# EAGLE design PecanPico4 (EAGLE 6.5.0)
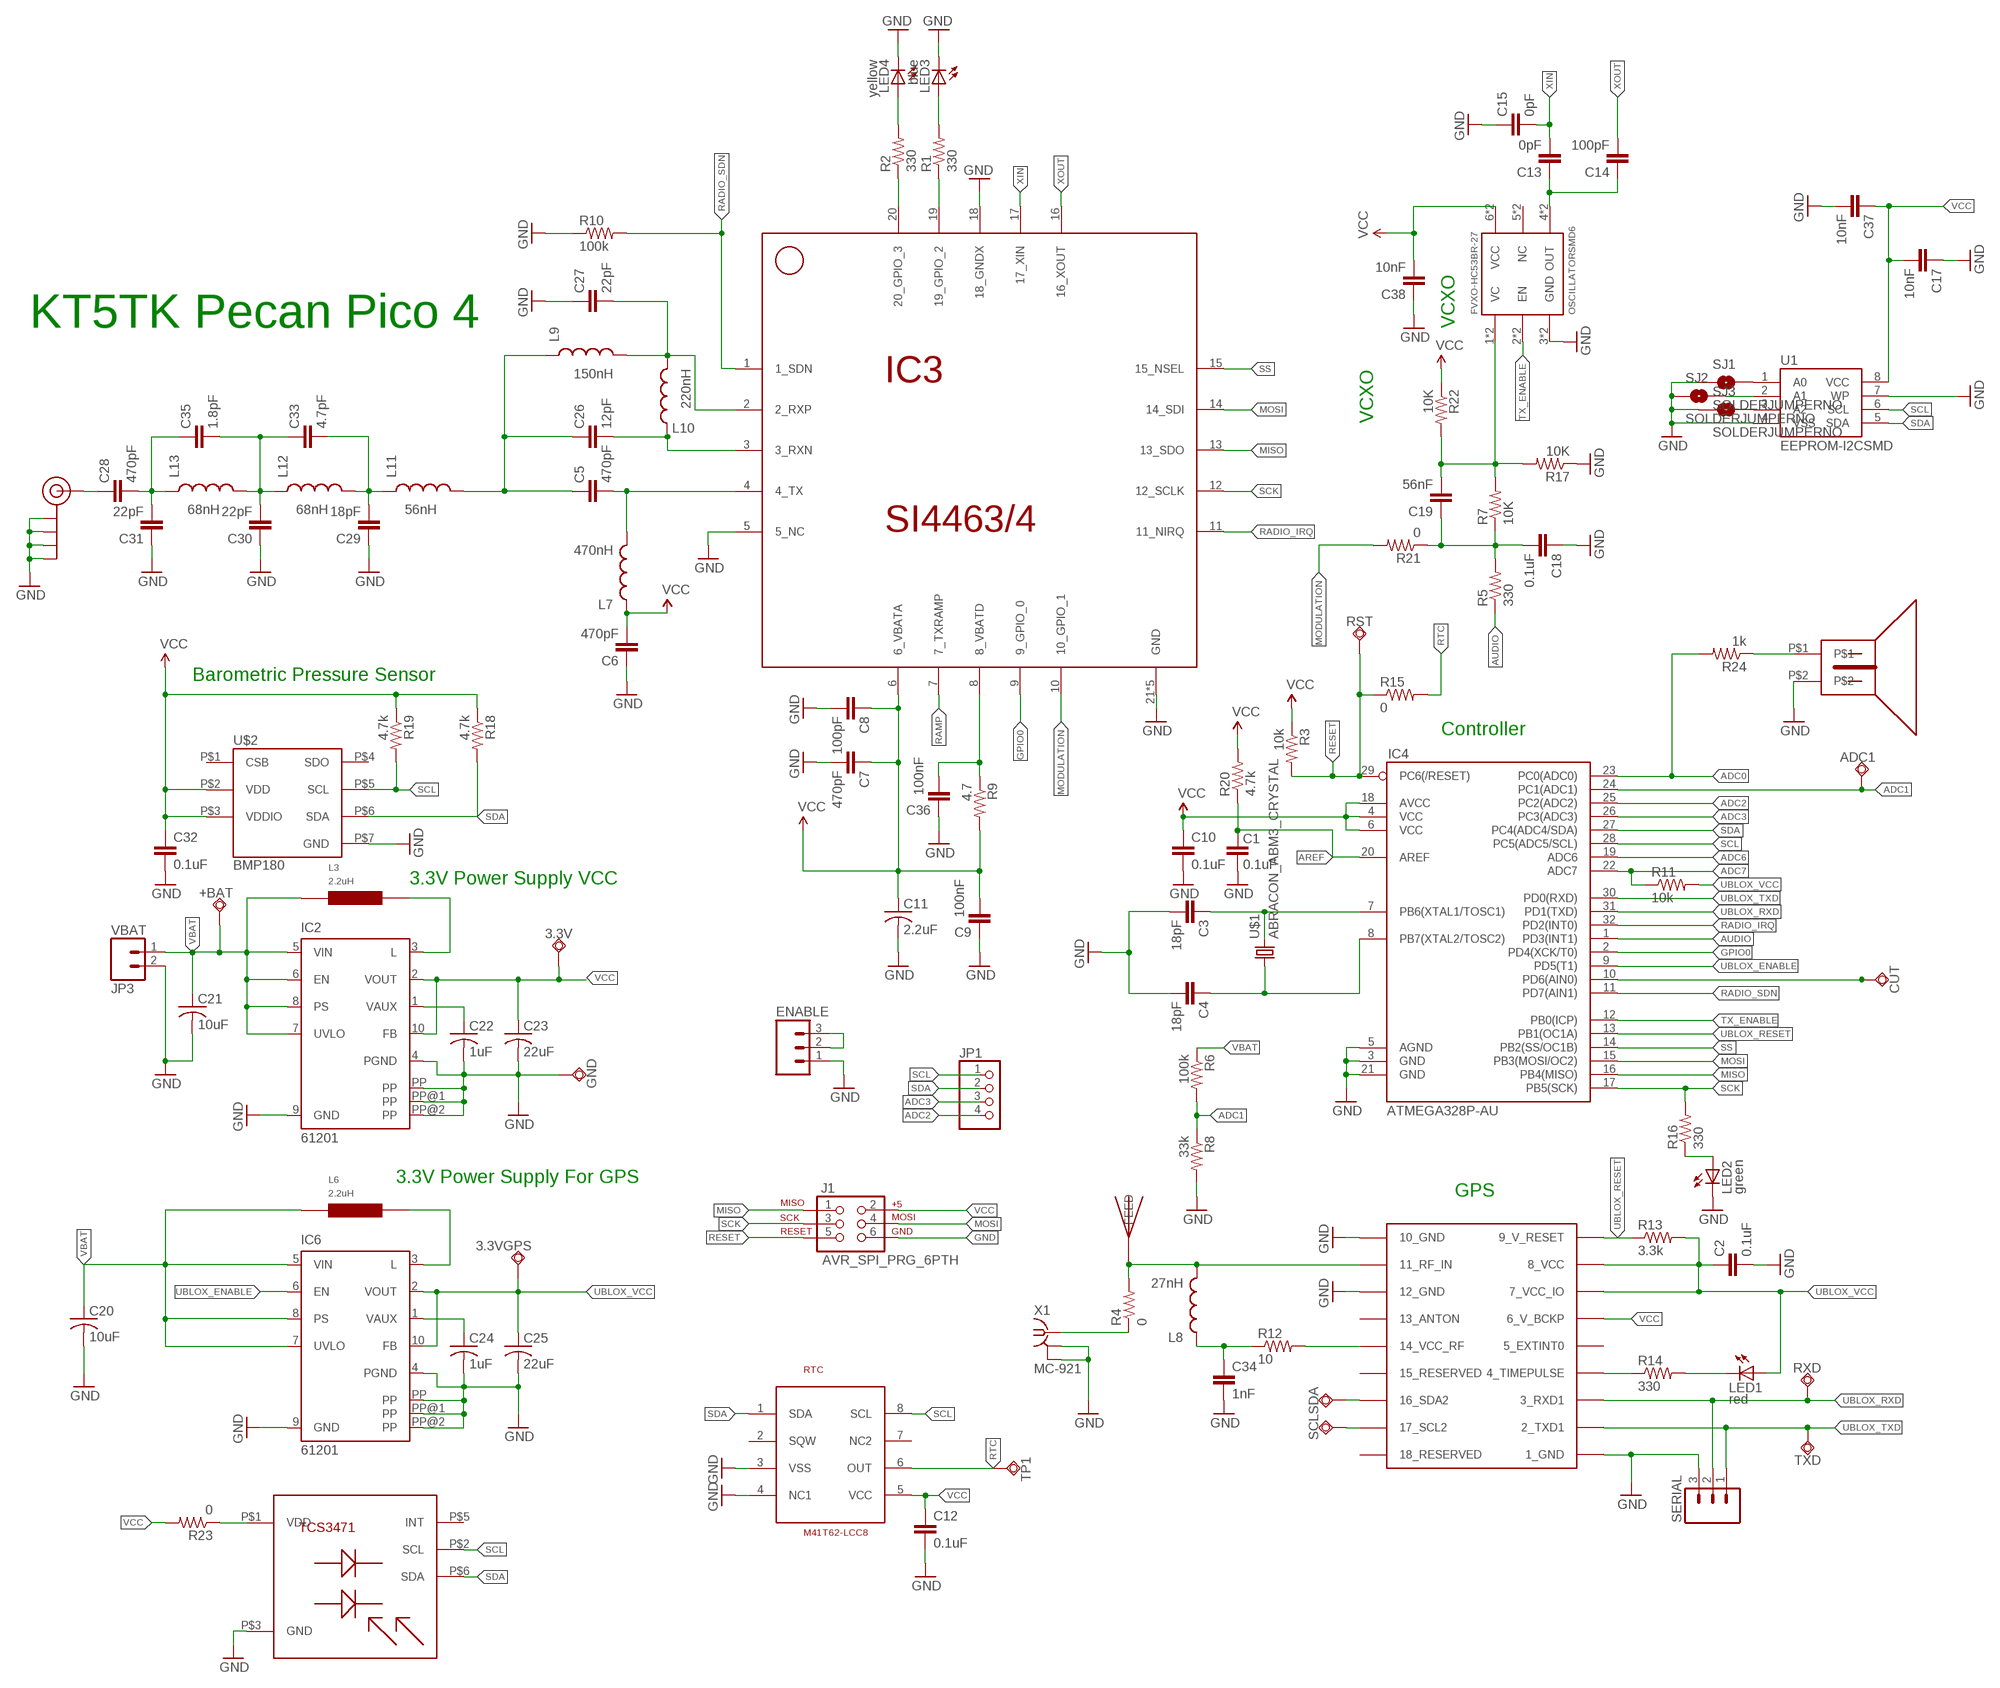
[diagram p0: schematic, sheet 1]

## Parts
3.3V  TPSQTP06R  [TP06R]
3.3VGPS  TPSQTP06R  [TP06R]
+BAT  TPSQTP06R  [TP06R]
ADC1  TPSQTP06R  [TP06R]
C1  0.1uF  CAP0402-CAP  [0402-CAP]
C2  0.1uF  CAP0402-CAP  [0402-CAP]
C3  18pF  CAP0402-CAP  [0402-CAP]
C4  18pF  CAP0402-CAP  [0402-CAP]
C5  470pF  CAP0402-CAP  [0402-CAP]
C6  470pF  CAP0402-CAP  [0402-CAP]
C7  470pF  CAP0402-CAP  [0402-CAP]
C8  100pF  CAP0402-CAP  [0402-CAP]
C9  100nF  CAP0402-CAP  [0402-CAP]
C10  0.1uF  CAP0402-CAP  [0402-CAP]
C11  2.2uF  C-USC1206  [C1206]
C12  0.1uF  CAP0402-CAP  [0402-CAP]
C13  0pF  CAP0402-CAP  [0402-CAP]
C14  100pF  CAP0402-CAP  [0402-CAP]
C15  0pF  CAP0402-CAP  [0402-CAP]
C17  10nF  CAP0402-CAP  [0402-CAP]
C18  0.1uF  CAP0402-CAP  [0402-CAP]
C19  56nF  CAP0402-CAP  [0402-CAP]
C20  10uF  C-USC1206  [C1206]
C21  10uF  C-USC1206  [C1206]
C22  1uF  C-USC1206  [C1206]
C23  22uF  C-USC1206  [C1206]
C24  1uF  C-USC1206  [C1206]
C25  22uF  C-USC1206  [C1206]
C26  12pF  CAP0402-CAP  [0402-CAP]
C27  22pF  CAP0402-CAP  [0402-CAP]
C28  470pF  CAP0402-CAP  [0402-CAP]
C29  18pF  CAP0402-CAP  [0402-CAP]
C30  22pF  CAP0402-CAP  [0402-CAP]
C31  22pF  CAP0402-CAP  [0402-CAP]
C32  0.1uF  CAP0402-CAP  [0402-CAP]
C33  4.7pF  CAP0402-CAP  [0402-CAP]
C34  1nF  CAP0402-CAP  [0402-CAP]
C35  1.8pF  CAP0402-CAP  [0402-CAP]
C36  100nF  CAP0402-CAP  [0402-CAP]
C37  10nF  CAP0402-CAP  [0402-CAP]
C38  10nF  CAP0402-CAP  [0402-CAP]
CUT  TPSQTP06R  [TP06R]
ENABLE  M03PTH  [1X03]
FVXO-HC53BR-27  OSCILLATORSMD6  [CRYSTAL-SMD-7.5X5.2-6PIN]
GND  TPSQTP06R  [TP06R]
IC2  61201  TPS61201  [S-PDSO-N10]
IC3  SI4463/4  [QFN-20]
IC4  ATMEGA328P-AU  ATMEGA168  [TQFP32-08]
IC5  UBLOX_MAX-6  [UBLOX_MAX-6]
IC6  61201  TPS61201  [S-PDSO-N10]
J1  AVR_SPI_PRG_6PTH  [2X3]
J$2  SMA_EDGE  [SMA-EDGE]
JP1  PINHD-1X4  [1X04]
JP3  VBAT  M02PTH  [1X02]
L3  2.2uH  LPS3015  [LPS3015]
L6  2.2uH  LPS3015  [LPS3015]
L7  470nH  INDUCTOR0603  [0603]
L8  27nH  INDUCTOR0603  [0603]
L9  150nH  INDUCTOR0603  [0603]
L10  220nH  INDUCTOR0603  [0603]
L11  56nH  INDUCTOR0603  [0603]
L12  68nH  INDUCTOR0603  [0603]
L13  68nH  INDUCTOR0603  [0603]
LED1  red  LED0603  [LED-0603]
LED2  green  LED0603  [LED-0603]
LED3  blue  LED0603  [LED-0603]
LED4  yellow  LED0603  [LED-0603]
R1  330  RESISTOR0402-RES  [0402-RES]
R2  330  RESISTOR0402-RES  [0402-RES]
R3  10k  RESISTOR0402-RES  [0402-RES]
R4  0  RESISTOR0402-RES  [0402-RES]
R5  330  RESISTOR0402-RES  [0402-RES]
R6  100k  RESISTOR0402-RES  [0402-RES]
R7  10K  RESISTOR0402-RES  [0402-RES]
R8  33k  RESISTOR0402-RES  [0402-RES]
R9  4.7  RESISTOR0402-RES  [0402-RES]
R10  100k  RESISTOR0402-RES  [0402-RES]
R11  10k  RESISTOR0402-RES  [0402-RES]
R12  10  RESISTOR0402-RES  [0402-RES]
R13  3.3k  RESISTOR0402-RES  [0402-RES]
R14  330  RESISTOR0402-RES  [0402-RES]
R15  0  RESISTOR0402-RES  [0402-RES]
R16  330  RESISTOR0402-RES  [0402-RES]
R17  10K  RESISTOR0402-RES  [0402-RES]
R18  4.7k  RESISTOR0402-RES  [0402-RES]
R19  4.7k  RESISTOR0402-RES  [0402-RES]
R20  4.7k  RESISTOR0402-RES  [0402-RES]
R21  0  RESISTOR0402-RES  [0402-RES]
R22  10K  RESISTOR0402-RES  [0402-RES]
R23  0  RESISTOR0402-RES  [0402-RES]
R24  1k  RESISTOR0402-RES  [0402-RES]
RST  TPSQTP06R  [TP06R]
RTC  M41T62-LCC8  [LCC-8]
RXD  TPSQTP06R  [TP06R]
SCL  TPSQTP06R  [TP06R]
SDA  TPSQTP06R  [TP06R]
SERIAL  M03PTH  [1X03]
SJ1  SOLDERJUMPERNO  [SJ_2S-NO]
SJ2  SOLDERJUMPERNO  [SJ_2S-NO]
SJ3  SOLDERJUMPERNO  [SJ_2S-NO]
SPKR  PKLCS1212E  [PKLCS1212E]
TCS3471  TCS4371FN  [TCS3471FN]
TP1  TPSQTP06R  [TP06R]
TXD  TPSQTP06R  [TP06R]
U1  EEPROM-I2CSMD  [SO08]
U$1  ABRACON_ABM3_CRYSTAL  [ABRACON_ABM3_CRYSTAL]
U$2  BMP180  [LGA-7]
U$3  JTI_ANTENNA-1575AT43A40  [JTI_ANTENNA-1575AT43A40]
X1  MC-921  [MC-921]

## Nets
ADC0: IC4.23(PC0(ADC0)) R24.2
ADC1: ADC1.TP IC4.24(PC1(ADC1)) R6.2 R8.1
ADC2: IC4.25(PC2(ADC2))
ADC3: IC4.26(PC3(ADC3))
ADC6: IC4.19(ADC6)
ADC7: IC4.22(ADC7) R11.1
AREF: C1.2 IC4.20(AREF) R20.1
AUDIO: IC4.1(PD3(INT1)) R5.1
CUT: CUT.TP IC4.10(PD6(AIN0))
GND [vcc]: C1.1 C2.2 C3.2 C4.2 C6.1 C7.2 C8.2 C9.1 C10.2 C11.2 C12.2 C15.1 C17.1 C18.1 C20.2 C21.2 C22.2 C23.2 C24.2 C25.2 C27.1 C29.1 C30.1 C31.1 C32.2 C34.2 C36.1 C37.2 C38.1 ENABLE.1 FVXO-HC53BR-27.3(GND) FVXO-HC53BR-27.3INNER(GND) GND.TP IC2.4(PGND) IC2.9(GND) IC2.PP IC2.PP@1(PP) IC2.PP@2(PP) IC3.5(5_NC) IC3.18(18_GNDX) IC3.21(GND) IC3.22(GND) IC3.23(GND) IC3.24(GND) IC3.25(GND) IC4.3(GND) IC4.5(AGND) IC4.21(GND) IC5.1_GND IC5.10_GND IC5.12_GND IC6.4(PGND) IC6.9(GND) IC6.PP IC6.PP@1(PP) IC6.PP@2(PP) J1.6 J$2.GND@0(GND) J$2.GND@1(GND) J$2.GND@2(GND) J$2.GND@3(GND) JP3.2 LED2.C LED3.C LED4.C R8.2 R10.1 R17.1 RTC.3(VSS) RTC.4(NC1) SERIAL.3 SJ1.1 SJ2.1 SJ3.1 SPKR.P$2 TCS3471.P$3(GND) U1.4(VSS) U1.7(WP) U$2.P$7(GND) X1.2@1(GND) X1.2@2(GND)
GPIO0: IC3.9(9_GPIO_0) IC4.2(PD4(XCK/T0))
GPSANT: IC5.11_RF_IN L8.2 R4.2 U$3.FEED
MISO: IC3.13(13_SDO) IC4.16(PB4(MISO)) J1.1
MODULATION: IC3.10(10_GPIO_1) R21.2
MOSI: IC3.14(14_SDI) IC4.15(PB3(MOSI/OC2)) J1.4
N$1: R23.1 TCS3471.P$1(VDD)
N$2: IC5.16_SDA2 SDA.TP
N$3: IC5.17_SCL2 SCL.TP
N$4: IC2.3(L) L3.P$2
N$5: IC3.20(20_GPIO_3) R2.1
N$6: C18.2 C19.1 R5.2 R7.1 R21.1
N$7: IC3.19(19_GPIO_2) R1.1
N$8: SJ1.2 U1.1(A0)
N$9: C3.1 IC4.7(PB6(XTAL1/TOSC1)) U$1.P$2
N$10: C4.1 IC4.8(PB7(XTAL2/TOSC2)) U$1.P$1
N$11: LED4.A R2.2
N$12: LED3.A R1.2
N$13: C13.1 C14.1 FVXO-HC53BR-27.4(OUT) FVXO-HC53BR-27.4INNER(OUT)
N$14: R4.1 X1.1
N$15: SJ3.2 U1.3(A2)
N$16: SJ2.2 U1.2(A1)
N$17: R24.1 SPKR.P$1
N$18: JP1.1
N$19: C22.1 IC2.1(VAUX)
N$20: IC6.3(L) L6.P$2
N$21: C19.2 FVXO-HC53BR-27.1(VC) FVXO-HC53BR-27.1INNER(VC) R7.2 R17.2 R22.2
N$22: C24.1 IC6.1(VAUX)
N$23: C5.2 IC3.4(4_TX) L7.2
N$24: C28.1 J$2.SIG(SIGNAL)
N$25: C26.2 IC3.3(3_RXN) L10.1
N$26: C27.2 IC3.2(2_RXP) L9.2 L10.2
N$27: C5.1 C26.1 L9.1 L11.2
N$28: C30.2 C33.1 C35.2 L12.1 L13.2
N$29: ENABLE.2 ENABLE.3
N$30: IC5.14_VCC_RF R12.2
N$31: C34.1 L8.1 R12.1
N$32: IC5.4_TIMEPULSE R14.1
N$33: LED1.C R14.2
N$34: C29.2 C33.2 L11.1 L12.2
N$35: C28.2 C31.2 C35.1 L13.1
N$36: LED2.A R16.1
N$37: JP1.2
N$38: JP1.3
N$39: JP1.4
N$41: C36.2 IC3.8(8_VBATD) R9.1
RADIO_IRQ: IC3.11(11_NIRQ) IC4.32(PD2(INT0))
RADIO_SDN: IC3.1(1_SDN) IC4.11(PD7(AIN1)) R10.2
RAMP: IC3.7(7_TXRAMP)
RESET: IC4.29(PC6(/RESET)) J1.5 R3.2 R15.1 RST.TP
RTC: R15.2 RTC.6(OUT) TP1.TP
SCK: IC3.12(12_SCLK) IC4.17(PB5(SCK)) J1.3 R16.2
SCL: IC4.28(PC5(ADC5/SCL)) R19.2 RTC.8(SCL) TCS3471.P$2(SCL) U1.6(SCL) U$2.P$5(SCL)
SDA: IC4.27(PC4(ADC4/SDA)) R18.2 RTC.1(SDA) TCS3471.P$6(SDA) U1.5(SDA) U$2.P$6(SDA)
SS: IC3.15(15_NSEL) IC4.14(PB2(SS/OC1B))
TX_ENABLE: FVXO-HC53BR-27.2(EN) FVXO-HC53BR-27.2INNER(EN) IC4.12(PB0(ICP))
UBLOX_ENABLE: IC4.9(PD5(T1)) IC6.6(EN)
UBLOX_RESET: IC4.13(PB1(OC1A)) IC5.9_V_RESET R13.1
UBLOX_RXD: IC4.31(PD1(TXD)) IC5.3_RXD1 RXD.TP SERIAL.2
UBLOX_TXD: IC4.30(PD0(RXD)) IC5.2_TXD1 SERIAL.1 TXD.TP
UBLOX_VCC: 3.3VGPS.TP C2.1 C25.1 IC5.7_VCC_IO IC5.8_VCC IC6.2(VOUT) IC6.10(FB) LED1.A R11.2 R13.2
VBAT [vcc]: +BAT.TP C20.1 C21.1 IC2.5(VIN) IC2.6(EN) IC2.7(UVLO) IC2.8(PS) IC6.5(VIN) IC6.7(UVLO) IC6.8(PS) JP3.1 L3.P$1 L6.P$1 R6.1
VCC: 3.3V.TP C6.2 C7.1 C8.1 C9.2 C10.1 C11.1 C12.1 C17.2 C23.1 C32.1 C37.1 C38.2 FVXO-HC53BR-27.6(VCC) FVXO-HC53BR-27.6INNER(VCC) IC2.2(VOUT) IC2.10(FB) IC3.6(6_VBATA) IC4.4(VCC) IC4.6(VCC) IC4.18(AVCC) IC5.6_V_BCKP J1.2 L7.1 R3.1 R9.2 R18.1 R19.1 R20.2 R22.1 R23.2 RTC.5(VCC) U1.8(VCC) U$2.P$2(VDD) U$2.P$3(VDDIO)
XIN: C13.2 C15.2 IC3.17(17_XIN)
XOUT: C14.2 IC3.16(16_XOUT)
Unconnected: FVXO-HC53BR-27.5(NC) FVXO-HC53BR-27.5INNER(NC) IC5.5_EXTINT0 IC5.13_ANTON IC5.15_RESERVED IC5.18_RESERVED RTC.2(SQW) RTC.7(NC2) TCS3471.P$5(INT) U$2.P$1(CSB) U$2.P$4(SDO)

## Notes on the sheet
- KT5TK Pecan Pico 4 | VCXO
- VCXO
- Barometric Pressure Sensor
- Controller
- 3.3V Power Supply VCC
- 3.3V Power Supply For GPS
- GPS

## Library data of the parts
3.3V 3.3VGPS +BAT ADC1 CUT GND RST RXD SCL SDA TP1 TXD = testpad:TPSQ: Test pad
C1-C10 C12-C15 C17-C19 C26-C38 = SparkFun:CAP: Capacitor Standard 0603 ceramic capacitor, and 0.1" leaded capacitor.
C11 C20-C25 = rcl:C-US: CAPACITOR, American symbol
ENABLE SERIAL = SparkFun-Connectors:M03: Header 3 Standard 3-pin 0.1" header. Use with straight break away headers (SKU : PRT-00116), right angle break away headers (PRT-00553), swiss pins (PRT-00743), machine pins (PRT-00117), and female headers (PRT-00115). Molex polarized connector foot print use with SKU : PRT-08232 with associated crimp pins and housings.
FVXO-HC53BR-27 = SparkFun-FreqCtrl_TK:OSCILLATOR: Generic 5x3 and 7x5 oscillators
IC2 IC6 = texas:TPS6120*: LOW INPUT VOLTAGE SYNCHRONOUS BOOST CONVERTER WITH 1.3-A SWITCHES Source: http://focus.ti.com/lit/ds/symlink/tps61200.pdf; MPN: TPS61201DRCT; OC_FARNELL: unknown; OC_NEWARK: 37M0068
IC3 = KT5TK:SI4463/4
IC4 = SparkFun:ATMEGA168
IC5 = ava:UBLOX_MAX-6: UBLOX MAX-6
J1 = SparkFun:AVR_SPI_PRG_6: AVR ISP 6 Pin This is the reduced ISP connector for AVR programming. Common on Arduino. This footprint will take up less PCB space and can be used with a 10-pin to 6-pin adapter such as SKU: BOB-08508
J$2 = SparkFun:SMA_EDGE: SMA Antenna Connector End launch SMA connector. The paste layer has been removed so that the connector can be hand soldered onto the board after reflow.
JP1 = pinhead:PINHD-1X4: PIN HEADER
JP3 = SparkFun:M02: Header 2 Standard 2-pin 0.1" header. Use with straight break away headers (SKU : PRT-00116), right angle break away headers (PRT-00553), swiss pins (PRT-00743), machine pins (PRT-00117), and female headers (PRT-00115). Molex polarized connector foot print use with SKU : PRT-08233 with associated crimp pins and housings.
L3 L6 = inductor-coilcraft-TK:LPS3015: LPS3015 Series Low Profile Shielded Power Inductors http://www.coilcraft.com/lps3015.cfm <0.058>
L7-L13 = SparkFun:INDUCTOR: Inductors Basic Inductor/Choke - 0603 and 1206. Footprints are not proven and vary greatly between part numbers.
LED1-LED4 = SparkFun:LED: LEDs Standard schematic elements and footprints for 5mm, 3mm, 1206, and 0603 sized LEDs. 5mm - Spark Fun Electronics SKU : COM-00529 (and others)
R1-R24 = SparkFun:RESISTOR: Resistor Basic schematic elements and footprints for 0603, 1206, and PTH resistors.
RTC = KT5TK:M41T62-LCC8
SJ1-SJ3 = SparkFun-Passives:SOLDERJUMPER: Solder Jumper Standard SMD solder jumper. Used to automate production. Two varients : Normally Open and Normally Closed are the same, but have different paste layers. NC will have a large amount of paste and should jumper during reflow.
SPKR = KT5TK:PKLCS1212E
TCS3471 = KT5TK:TCS4371FN: TCS4371FN Color Sensor The TCS3471 family of devices provides red, green, blue, and clear light sensing (RGBC) that detects light intensity under a variety of lighting conditions and through a variety of attenuation materials. An internal state machine provides the ability to put the device into a low power mode in between RGBC measurements providing very low average power consumption. The TCS3471 is directly useful in lighting conditions containing minimal IR content such as LED RGB backlight control, reflected LED color sampler, or fluorescent light color temperature detector. With the addition of an IR blocking filter, the device is an excellent ambient light sensor, color temperature monitor, and general purpose color sensor.
U1 = SparkFun-DigitalIC:EEPROM-I2C: I2C EEPROM chips, 24LC256 (and others)
U$1 = ava:ABRACON_ABM3_CRYSTAL
U$2 = projecttree:BMP180
U$3 = ava:JTI_ANTENNA-1575AT43A40
X1 = con-coax:MC-921: COAX. MICROWAVE CONNECTOR O/D diam 2.1 Source: www.tycoelectronics.com .. Electronics .. ENG_CD_1775146_A2.pdf; OC_FARNELL: unknown; OC_NEWARK: unknown

## Net classes
0 default: width 0.203 mm
1 vcc: width 0.254 mm

## Board
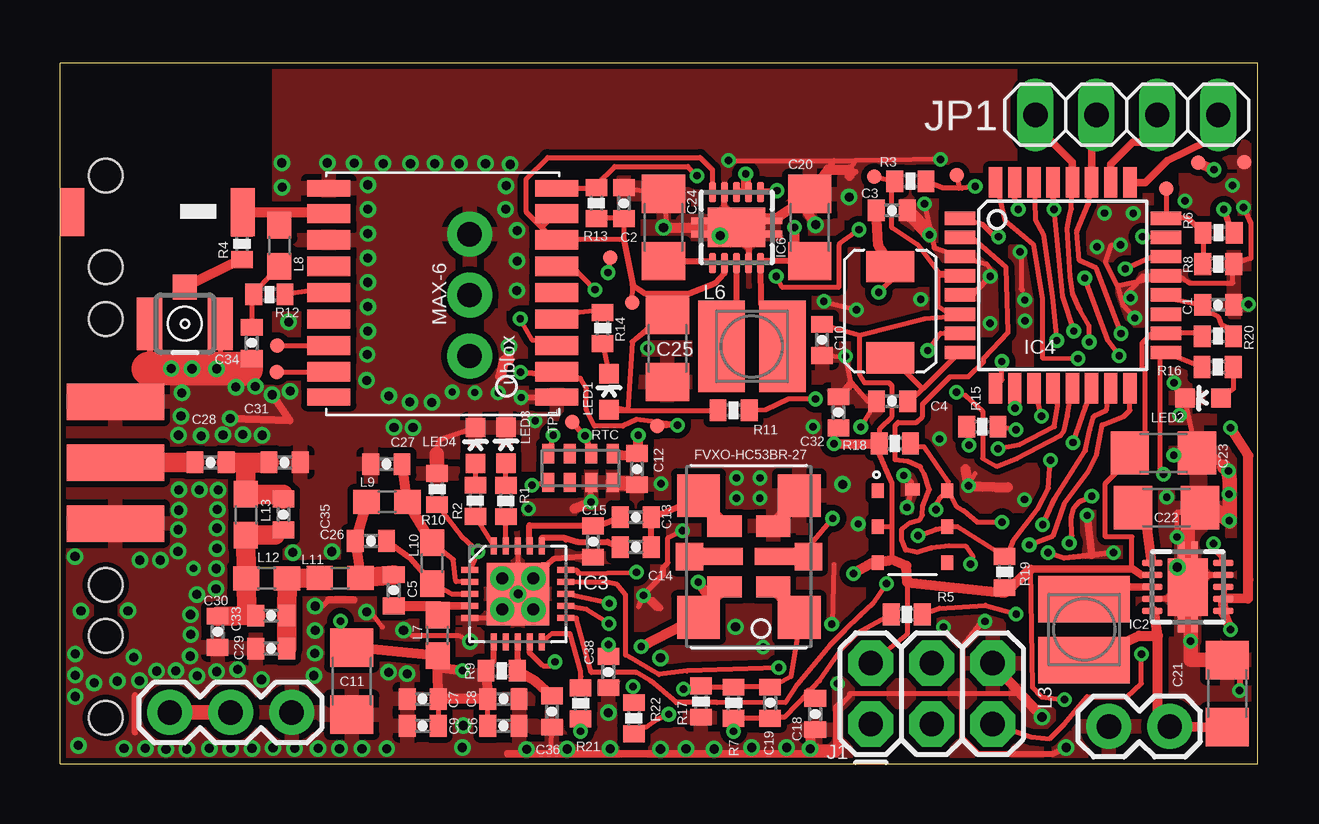
[diagram p1: board, top side]
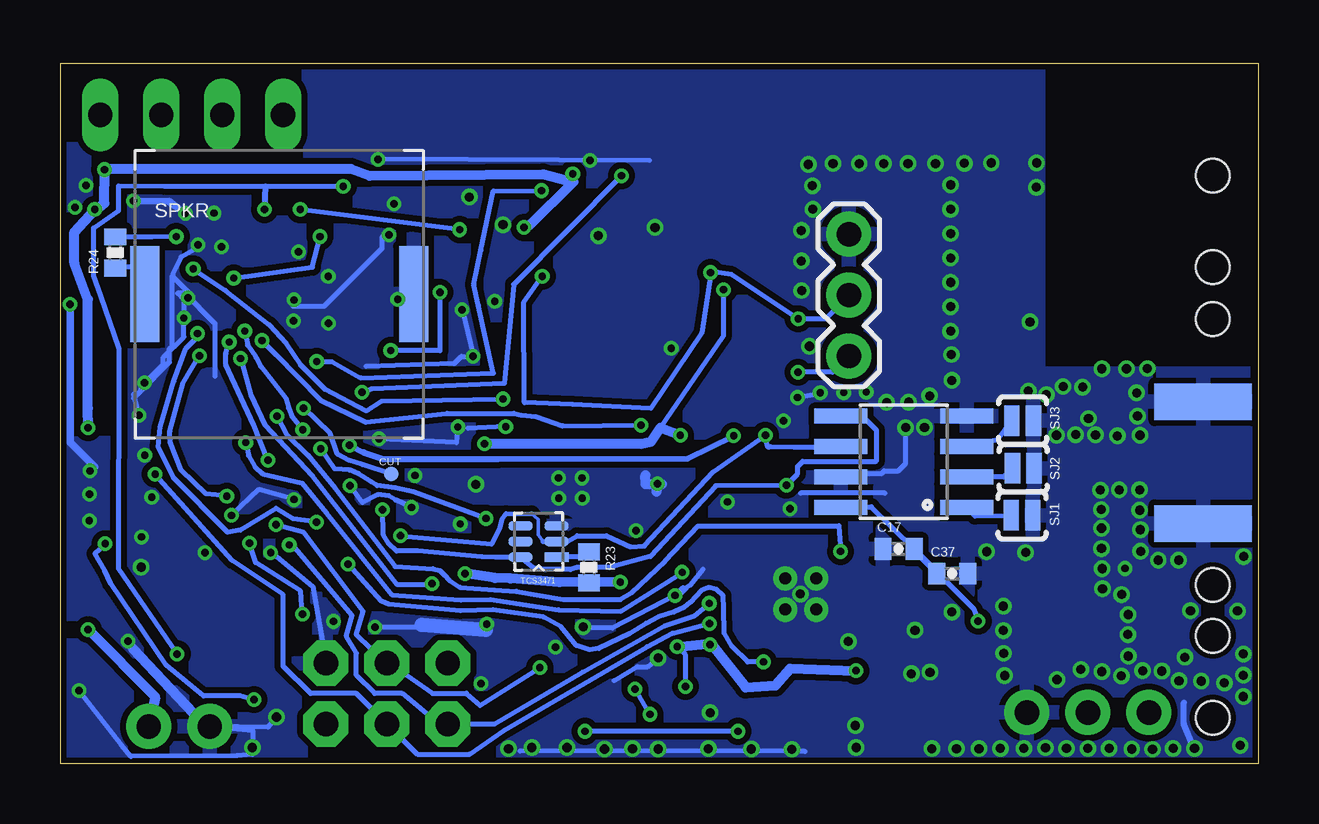
[diagram p2: board, bottom side, seen from below]

Size 49.91 x 29.21 mm. Coordinates in mm from the lower left corner, seen from the top.
Outline: 0,0 49.91,0 49.91,29.21 0,29.21 0,0
Copper layers (1*16): Top 0.035mm / dielectric 1.5mm / Bottom 0.035mm
Design rules "Fusion_eagle_rule_v1.1": minimum track width 6mil, minimum drill 12mil, track to track 6mil, track to pad 6mil, pad to pad 6mil, via to via 6mil, smd to smd 0mil, copper to edge 10mil, drill to drill 10mil, minimum pad ring 10mil, minimum via ring 6mil, stop-mask expansion 2mil, vias tented up to drill 100mil, thermal gap 10mil
Holes 1.4 mm at 1.91,18.54 1.91,20.7 1.91,24.51 1.91,7.44 1.91,5.33 1.91,1.91

### Footprints (pad centres in the part's own frame; a part is rotated, then mirrored left to right if it is on the bottom)
TP06R = smd 0.6 x 0.6: TP 0,0
0402-CAP = smd 0.7 x 0.9: 1 -0.65,0; 2 0.65,0
C1206 = smd 1.6 x 1.8: 1 -1.4,0; 2 1.4,0
1X03 = drill 1.016 pad 1.88: 1 0,0; 2 2.54,0; 3 5.08,0
CRYSTAL-SMD-7.5X5.2-6PIN = smd 1.778 x 1.778: 1 -2.54,-2.1; 3 2.54,-2.1; 4 2.54,2.1; 6 -2.54,2.1 | smd 0.889 x 1.422: 1INNER -1.27,-1.016; 3INNER 1.27,-1.016; 4INNER 1.27,1.016; 6INNER -1.27,1.016 | smd 1.143 x 1.143: 2 0,-2.481; 5 0,2.481 | smd 0.711 x 1.778: 2INNER 0,-1.143; 5INNER 0,1.143
S-PDSO-N10 = smd 0.28 x 0.85: 1 -1,-1.475; 2 -0.5,-1.475; 3 0,-1.475; 4 0.5,-1.475; 5 1,-1.475; 6 1,1.475; 7 0.5,1.475; 8 0,1.475; 9 -0.5,1.475; 10 -1,1.475 | smd 2.4 x 1.65: PP 0,0 | smd 3.8 x 0.28: PP@1 0,0.275; PP@2 0,-0.275
QFN-20 = smd 0.7 x 0.25: 1 -2,1; 2 -2,0.5; 3 -2,0; 4 -2,-0.5; 5 -2,-1; 11 2,-1; 12 2,-0.5; 13 2,0; 14 2,0.5; 15 2,1 | smd 0.25 x 0.7: 6 -1,-2; 7 -0.5,-2; 8 0,-2; 9 0.5,-2; 10 1,-2; 16 1,2; 17 0.5,2; 18 0,2; 19 -0.5,2; 20 -1,2 | smd 2.6 x 2.6: 21 0,0 | drill 0.5: 22 -0.65,0.65; 23 0.65,0.65; 24 0.65,-0.65; 25 -0.65,-0.65
TQFP32-08 = smd 1.27 x 0.559: 1 -4.293,2.8; 2 -4.293,2; 3 -4.293,1.2; 4 -4.293,0.4; 5 -4.293,-0.4; 6 -4.293,-1.2; 7 -4.293,-2; 8 -4.293,-2.8; 17 4.293,-2.8; 18 4.293,-2; 19 4.293,-1.2; 20 4.293,-0.4; 21 4.293,0.4; 22 4.293,1.2; 23 4.293,2; 24 4.293,2.8 | smd 0.559 x 1.27: 9 -2.8,-4.293; 10 -2,-4.293; 11 -1.2,-4.293; 12 -0.4,-4.293; 13 0.4,-4.293; 14 1.2,-4.293; 15 2,-4.293; 16 2.8,-4.293; 25 2.8,4.293; 26 2,4.293; 27 1.2,4.293; 28 0.4,4.293; 29 -0.4,4.293; 30 -1.2,4.293; 31 -2,4.293; 32 -2.8,4.293
UBLOX_MAX-6 = smd 1.8 x 0.7: 1_GND 4.95,-4.4; 9_V_RESET 4.95,4.3; 10_GND -4.55,4.3; 18_RESERVED -4.55,-4.4 | smd 1.8 x 0.8: 2_TXD1 4.95,-3.35; 3_RXD1 4.95,-2.25; 4_TIMEPULSE 4.95,-1.15; 5_EXTINT0 4.95,-0.05; 6_V_BCKP 4.95,1.05; 7_VCC_IO 4.95,2.15; 8_VCC 4.95,3.25; 11_RF_IN -4.55,3.25; 12_GND -4.55,2.15; 13_ANTON -4.55,1.05; 14_VCC_RF -4.55,-0.05; 15_RESERVED -4.55,-1.15; 16_SDA2 -4.55,-2.25; 17_SCL2 -4.55,-3.35
2X3 = drill 1.016 pad 1.88 octagon: 1 0,0; 2 0,2.54; 3 2.54,0; 4 2.54,2.54; 5 5.08,0; 6 5.08,2.54
SMA-EDGE = smd 1.524 x 4.064: GND@0 0,0; GND@1 5.08,0; SIG 2.54,0 | smd 1.524 x 4.064 bottom: GND@2 0,0; GND@3 5.08,0
1X04 = drill 1.016 long: 1 -3.81,0; 2 -1.27,0; 3 1.27,0; 4 3.81,0
1X02 = drill 1.016 pad 1.88: 1 0,0; 2 2.54,0
LPS3015 = smd 1.93 x 3.81: P$1 -1.27,0; P$2 1.27,0
0603 = smd 1.1 x 1: 1 -0.85,0; 2 0.85,0
LED-0603 = smd 0.8 x 0.8: A 0,-0.75; C 0,0.75
0402-RES = smd 0.7 x 0.9: 1 -0.65,0; 2 0.65,0
LCC-8 = smd 0.5 x 0.8: 1 -1.35,-0.6; 2 -0.45,-0.6; 3 0.45,-0.6; 4 1.35,-0.6; 5 1.35,0.6; 6 0.45,0.6; 7 -0.45,0.6; 8 -1.35,0.6
SJ_2S-NO = smd 0.635 x 1.27: 1 -0.45,0; 2 0.45,0
PKLCS1212E = smd 1.2 x 4: P$1 -5.6,0; P$2 5.6,0
TCS3471FN = smd 1 x 0.4: P$1 -0.75,0.65; P$2 -0.75,0; P$3 -0.75,-0.65; P$4 0.75,-0.65; P$5 0.75,0; P$6 0.75,0.65
SO08 = smd 0.61 x 2.21: 1 -1.905,-2.616; 2 -0.635,-2.616; 3 0.635,-2.616; 4 1.905,-2.616; 5 1.905,2.616; 6 0.635,2.616; 7 -0.635,2.616; 8 -1.905,2.616
ABRACON_ABM3_CRYSTAL = smd 1.3 x 2: P$1 -3.4,0.1; P$2 0.4,0.1
LGA-7 = smd 0.6 x 0.5: P$1 1.5,1.45; P$2 0,1.45; P$3 -1.5,1.45; P$4 -1.5,-1.45; P$5 0,-1.45; P$6 1.5,-1.45 | smd 0.5 x 0.6: P$7 1.55,0
JTI_ANTENNA-1575AT43A40 = smd 1 x 2: FEED -3.81,-1.27; NC 3.29,-1.27
MC-921 = smd 1 x 1.05: 1 0,1.528 | smd 1.05 x 2.2: 2@1 -1.475,0; 2@2 1.475,0

### Placement (x,y rotation side)
3.3V  33.92,24.47 90 top
3.3VGPS  23.84,19.23 0 top
+BAT  47.43,25.06 0 top
ADC1  46.09,23.96 0 top
C1  48.26,19.13 180 top
C2  23.5,23.37 90 top
C3  34.66,23.06 0 top
C4  34.67,15.11 180 top
C5  13.91,7.23 270 top
C6  18.48,1.57 180 top
C7  15.11,2.69 180 top
C8  18.48,2.69 0 top
C9  15.11,1.57 0 top
C10  31.75,17.67 270 top
C11  12.15,3.44 270 top
C12  24.04,12.28 270 top
C13  23.99,10.27 180 top
C14  23.99,9.03 180 top
C15  22.21,9.26 90 top
C17  15,8.95 0 bottom
C18  31.47,2.07 90 top
C19  29.59,2.54 90 top
C20  31.24,22.35 90 top
C21  48.64,2.92 90 top
C22  46.1,10.67 0 top
C23  45.97,12.95 0 top
C24  25.15,22.35 90 top
C25  25.31,17.31 270 top
C26  12.95,9.28 0 top
C27  13.6,12.48 0 top
C28  6.27,12.56 0 top
C29  8.8,4.8 0 top
C30  6.57,5.5 90 top
C31  9.36,12.56 180 top
C32  32.44,14.64 90 top
C33  8.8,6.17 0 top
C34  7.99,17.54 270 top
C35  9.31,10.39 270 top
C36  20.5,2.17 90 top
C37  12.76,7.92 0 bottom
C38  22.85,3.82 90 top
CUT  36.14,12.08 0 bottom
ENABLE  9.65,2.13 180 top
FVXO-HC53BR-27  28.7,8.64 90 top
GND  49.34,25.07 0 top
IC2  46.99,7.37 270 top
IC3  19.08,7.07 0 top
IC4  41.78,19.94 0 top
IC5  15.75,19.68 0 top
IC6  28.19,22.35 0 top
J1  33.78,1.65 0 top
J$2  2.31,10.01 90 top
JP1  44.45,27.05 0 top
JP3  46.24,1.55 180 top
L3  42.67,5.59 90 top
L6  28.83,17.4 180 top
L7  15.74,5.35 90 top
L8  9.14,21.59 90 top
L9  13.63,10.91 0 top
L10  15.51,8.36 90 top
L11  11.67,7.73 0 top
L12  8.61,7.72 0 top
L13  7.75,10.38 270 top
LED1  22.87,15.51 0 top
LED2  47.62,15.24 90 top
LED3  18.58,13.27 0 top
LED4  17.31,13.26 0 top
R1  18.58,10.95 90 top
R2  17.31,10.96 90 top
R3  35.43,24.28 0 top
R4  7.58,21.67 90 top
R5  35.28,6.22 180 top
R6  48.27,22.14 180 top
R7  28.07,2.54 90 top
R8  48.26,20.83 0 top
R9  18.4,3.87 180 top
R10  15.71,11.44 270 top
R11  28.07,14.73 180 top
R12  8.72,19.56 0 top
R13  22.35,23.37 270 top
R14  22.61,18.16 270 top
R15  38.43,14.05 180 top
R16  48.23,16.54 180 top
R17  26.71,2.59 90 top
R18  34.79,13.35 0 top
R19  39.36,7.99 90 top
R20  48.25,17.82 180 top
R21  21.69,2.51 90 top
R22  23.91,1.89 270 top
R23  27.9,8.18 270 bottom
R24  47.64,21.31 90 bottom
RST  37.36,24.54 0 top
RTC  21.69,12.32 0 top
RXD  22.92,21.11 0 top
SCL  9.03,16.33 0 top
SDA  9.04,17.44 0 top
SERIAL  17.07,16.99 90 bottom
SJ1  9.86,10.35 180 bottom
SJ2  9.8,12.31 180 bottom
SJ3  9.83,14.3 180 bottom
SPKR  40.81,19.57 0 bottom
TCS3471  30,9.26 180 bottom
TP1  21.35,14.25 0 top
TXD  24.89,14.08 0 top
U1  14.78,12.59 90 bottom
U$1  34.7,20.32 90 top
U$2  35.52,9.88 90 top
U$3  3.81,21.72 180 top
X1  5.21,18.34 0 top

### Tracks (layer width: path | path; a pad name or v marks a point on that pad's centre or on a via)
ADC0  (via drill 0.3 pad 0.3)
  Top 0.203: v45.1,21.97 IC4.23 46.04,21.91
  Bottom 0.203: v45.1,21.97 46.11,21.96 R24.2
ADC1
  Top 0.203: ADC1.TP IC4.24 | IC4.24 46.08,22.76 | R8.1 47.62,20.83 47.62,21.97 R6.2 47.02,22.74 IC4.24
ADC2
  Top 0.305: IC4.25 45.21,24.23 46.13,25.15 47.8,25.96
ADC3
  Top 0.305: IC4.26 43.78,24.99 44.7,25.91 45.31,25.91 45.72,26.31
ADC7  (via drill 0.3)
  Top 0.203: R11.1 29.4,14.74 30.37,15.2 v31.48,15.2 | v44.39,20.62 45.44,21.11 45.97,21.08 IC4.22
  Bottom 0.203: v31.48,15.2 36.54,15.11 37.17,14.71 38.91,15.61 39.92,16.61 40.53,17.54 41.21,18.29 43.05,19.72 v44.39,20.62
AREF
  Top 0.203: IC4.20 46.1,19.43 C1.2 47.75,19.43 47.93,18.8 48.26,18.63 48.39,18.31 48.93,18.07 48.93,18.01 R20.1
AUDIO  (via drill 0.3, 0.3 pad 0.25)
  Top 0.203: R5.1 36.64,6.48 38.56,6.6 v39.84,6.24 | v42.05,9.2 42.16,9.5 42.14,10.26 42.24,10.64 42.49,10.94 v42.99,11.15 | v44.13,17 43.65,17.65 v42.7,20.24 | v39.1,21.97 38.88,22.06 38.46,22.48 38.38,22.49 IC4.1
  Bottom 0.203: v39.84,6.24 39.92,7.2 41.78,8.38 v42.05,9.2 | v42.99,11.15 43.87,11.25 44.88,12.22 45.34,13.39 45.36,13.86 44.81,15.89 v44.13,17 | v42.7,20.24 39.42,20.7 v39.1,21.97
CUT  (via drill 0.3)
  Top 0.203: v39.79,14.82 IC4.10
  Bottom 0.203: CUT.TP 37.34,12.47 37.9,12.65 38.38,12.9 38.68,13.77 v39.79,14.82
GND  (via drill 0.3, 0.3 pad 0.25, 0.3 pad 0.3, 0.38 pad 0.25)
  Top 0.203: C34.2 6.71,16.84 | 6.71,16.84 X1.2@2 | v19.21,15.27 21.46,15.24 21.26,15.24 | 21.26,15.24 20.7,15.24 | 20.7,15.37 20.7,15.24 | IC5.1_GND 20.7,15.24 | C2.2 C24.2 25.27,22.35 | 30.86,23.41 C20.2 | v36.02,23.34 36.42,21.51 IC4.3 38.61,20.83 38.89,20.4 v38.76,20.32 | v44.18,21.63 43.79,21.6 43.56,20.9 44.06,19.94 | 44.06,19.94 IC4.21 | C23.2 46.86,15.24 | v49.31,23.19 49.62,22.52 49.62,21.07 R8.2 48.87,20.83 48.87,20.04 47.05,20.04 46.75,20.26 46.08,20.26 IC4.21 | v46.55,9.45 46.55,10.49 46.99,10.49 | 39.88,2.92 37.59,2.92 32.89,2.92 32.89,2.82 32.41,2.34 | 6.68,16.89 v6.53,16.46 6.66,16.79 6.71,16.84 | 33.15,25.15 32.89,24.77 | v27.85,25.15 32.26,25.15 | 32.26,25.15 33.15,25.15 | v36.69,25.2 33.15,25.15 | 32.26,25.15 31.62,24.38 30.48,23.11 29.84,22.73 27.69,22.73 27.69,23.88 | C10.2 v32.73,16.98 32.92,15.93 C32.2 32.92,15.68 32.99,15.89 33.66,15.11 C4.2 v33.36,14.03 | 31.8,19.27 v33.19,18.92 | 15.7,12.9 15.67,12.92 15.72,12.99 15.68,13.02 15.65,13.03 15.67,13.07 15.82,13.51 LED4.C | 21.26,15.2 21.26,15.24 | v41.16,8.8 41.83,8.59 42.99,8.69 | v7.33,15.7 7.76,16.46 | IC3.5 19.47,6.08 IC3.25 | v43.89,8.8 42.99,8.69 | 42.99,8.69 43.84,8.8 41.83,8.57 | 25.12,8.17 25.32,8.37 25.32,9.41 v25.93,9.72 | IC3.18 v19.09,7.07 | v19.09,7.07 19.07,7.96 | 20.27,8.29 20.09,8.29 v19.09,7.07 | 13.44,5.69 13.09,6.13 v12.78,6.33 | 14.67,5.35 16.6,5.35 v17.09,5.09 | 40.09,19.74 40.04,19.79 40.04,21.3 v40.01,21.34 | 32.35,0.42 32.35,0.51 32.41,0.57 | U$2.P$7 35.47,11.75 v35.15,12.01 35.43,11.76 35.47,11.47 v35.29,10.68 | v37.85,11.58 38.13,12.09 38.13,12.1 | 24.11,6.54 24.28,7.04 v24.31,7.01 24.84,6.48 25.04,6.48 24.68,6.84 24.67,6.84 24.7,6.8 24.74,6.8
  Top 0.203: v21.13,0.61 20.46,0.6 C36.1 | 11.19,6.82 10.94,6.57 v10.63,6.57 | 44.06,19.94 44.28,19.11 v44.78,18.58 | 32.24,8.29 32.17,5.86 32.14,5.83 v32.16,5.82 | v44.6,19.42 44.45,19.57 44.45,19.61 44.88,20.04 44.88,20.09 45.13,20.34 IC4.21 | LED2.C 46.44,15.67 v46.42,15.88 | v4.64,16.47 4.76,16.34 v5.5,16.46
  Top 0.254: 27.69,23.88 IC6.9 27.69,23.75 27.69,23.24 28.19,22.73 IC6.PP 28.19,21.97 28.7,21.46 28.7,20.95 IC6.4 | 48.51,7.87 IC2.9 48.39,7.87 47.88,7.87 47.37,7.37 IC2.PP 46.61,7.37 46.1,6.86 45.59,6.86 IC2.4 | FVXO-HC53BR-27.3INNER 29.72,10.16 30.73,11.18 FVXO-HC53BR-27.3 | v49.15,3.05 49.15,3.81 C21.2 | 32.89,24.51 33.15,24.67 | IC4.5 37.49,19.56 38.02,19.56 38.81,20.34 38.89,20.4 | v41.92,0.67 41.94,0.67 41.33,0.39 38.25,0.39 37.59,1.05 37.59,2.92 37.59,4.84 38.44,5.96 | 21.26,15.2 v19.21,15.27 | 3.12,1.29 3.12,2.86 | v22.12,10.91 22.12,11.58 22.14,11.6 RTC.3 | 25.07,11.62 25.09,11.57 | 25.12,8.17 25.12,7.86 v24.31,7.01 | v19.09,7.07 20.28,8.26 20.6,8.55 21.74,8.64 22.08,8.74 C15.1 | X1.2@1 3.73,16.49 3.75,16.47 v4.64,16.47 | 25.32,0.39 23.32,0.38 v22.92,0.62
  Top 0.305: v8.84,15.38 9.56,14.3 v7.09,14.39 | v42.8,10.35 42.99,8.69 | C23.2 47.92,12.95 48.5,12.37 | v48.69,12.21 v48.68,12.19 | 18.66,0.42 32.35,0.42 | 11.19,6.82 12.24,6.82
  Top 0.406: 25.27,22.35 IC6.PP | 28.19,22.73 29.84,22.73 30.86,23.41 v31.48,22.47 | J1.6 v40.92,1.94 | C20.2 32,24.77 32.89,24.77 32.89,24.51 | 21.44,10.63 v22.12,10.91 | 37.72,12.27 v37.85,11.58 39.5,11.52 | C18.1 31.25,1.42 v31.25,0.62 31.55,0.62 31.55,0.57 32.41,0.57 32.41,2.34 | 18.34,16.15 18.49,16.82 18.71,16.82 v18.71,17.4
  Top 0.61: C21.2 47.12,4.32 47.12,6.6 47.37,7.37 | C22.2 46.99,10.67 46.99,10.49 IC2.PP | C3.2 v36.23,22.05 | R10.1 15.7,12.9 | RTC.4 C12.2 | 48.5,12.37 v48.69,12.21 | 48.04,10.64 48.74,10.1 48.74,11.82 v48.68,12.19
  Top 1.422: 7.76,16.46 3.68,16.47
  Bottom 0.203: v40.92,1.94 41.27,1.52 JP3.2 41.91,1.4 41.91,0.38 42.57,0.33 46.99,0.3 47.37,0.76 v49.15,3.05 | v40.18,11.01 41.66,11.43 v42.8,10.35 | v19.21,15.27 v18.26,15.46 | v33.19,18.92 32.73,17 | 41.16,8.85 39.41,7.39 38.85,4.18 | 25.38,25.15 v36.69,25.2 | v33.36,14.03 33.43,13.39 v36.65,13.54 | 23.15,8.1 23.67,7.44 24.28,7.04 | 24.28,7.04 26.92,5.65 28.07,5.66 | v31.37,14.05 32.94,13.98 | 26.85,3.45 25.88,4.04 25.45,4.04 v25.02,4.41 | 30.77,0.53 18.9,0.51 19.71,0.51 v19.44,0.6 | v35.29,10.68 35.95,10.99 36.23,11.16 36.69,11.21 37.34,10.88 v37.85,11.58 | U1.7 17.26,12.09 R10.1 15.6,12.21 15.01,12.21 14.71,12.51 v14.71,14.01 | 34.86,5.79 34.96,5.69 v36.82,5.69 | 15.57,11.28 19.07,11.28 | v35.87,19.36 35.29,19.93 SPKR.P$2 | v36.23,22.05 36.06,22.18 36.27,22.18 36.53,21.93 36.53,21.48 38.94,19.06 40.22,19.06 | 44.13,21.57 44.9,21.12 45.24,20.41 | 43.48,16.14 43.48,18.35 44.74,19.61 45.03,19.61 44.78,19.36 v44.78,18.58 44.78,17.79 45.63,16.94 45.63,16.64 46.42,15.85 46.39,15.93 46.52,15.8 46.57,15.54 | 37.2,16.56 33.52,16.68 33.21,16.98 v32.73,16.98 | 24.28,7.04 23.99,7.33 23.84,7.33 24.16,7.01 v24.31,7.01 | v46.65,14.53 46.88,15.39 LED2.C 46.57,15.54 | 46.57,15.54 45.38,16.74 45.38,17.3 45.26,17.41 45.26,20.32 44.6,19.66 v44.6,19.42 | v46.42,15.88 v46.43,15.88 46.43,15.93 46.44,15.91 46.44,15.89
  Bottom 0.254: v46.88,23.46 45.47,23.44 v44.72,22.94 44.68,22.91 45.39,23.47 v46.88,23.46 | v46.88,23.46 46.83,23.42 | 2.68,0.61 3.11,1.66 3.11,2.54 | v41.16,8.8 41.16,8.85
  Bottom 0.305: v48.69,12.21 48.5,12.37 49.52,13.39 v49.52,19.15
  Bottom 0.406: v25.04,11.67 24.86,11.66 25.09,11.62 25.08,11.34 25.08,11.65 25.54,11.65 25.55,12.01 | 46.9,4.8 43.74,1.44
  Bottom 0.61: 32.21,5.58 34.86,5.79
  other vias: 29.17,11.91 43.52,22.95 25.15,22.35 12.83,18.03 43.21,21.55 5.08,15.46 6.79,13.7 5.88,13.67 19.52,10.63 17.73,25.02 5.04,14.49 7.62,13.72 8.42,13.69 11.33,8.84 46.56,8.19 19.8,14.3 4.94,13.69 12.8,17.06 12.78,15.98 8.14,15.72 9.59,15.53 9.53,18.41 12.83,19.05 12.83,20.07 12.83,21.08 12.83,22.1 12.83,23.11 12.83,24.13 19.04,19.72 19.05,20.95 19.05,22.23 18.57,23.11 18.76,24.98 16.64,25.02 15.62,25.02 14.61,25.02 13.46,25.02 9.26,24.03 9.25,25.04 11.14,25.04 12.26,25.03 48.86,24.1 28.18,11.06 29.16,11.06 28.19,11.91 27.25,0.61 9.78,0.64 5.71,3.66 8,0.64 7.11,0.64 6.22,0.64 3.56,0.64 2.67,0.64 0.76,0.76 0.64,2.79 0.64,3.68 0.64,4.57 0.88,6.36 38.75,18.36 32.88,23.62 31.83,19.28 24.47,17.31 27.51,22.01 25.02,0.61 38.54,5.93 16.8,1.59 13.69,3.81 10.63,5.55 10.62,4.6 10.58,3.67 8.39,3.51 9.7,8.8 6.5,7.29 6.59,11.4 6.52,8.13 6.54,8.97 6.54,9.82 6.55,10.59 5.8,11.42 4.95,11.42 4.95,10.57 4.93,9.75 4.91,8.85 4.18,8.48 3.33,8.48 0.62,8.64 5.7,7.05 5.44,6.21 5.45,5.38 5.42,4.48 6.53,3.84 7.4,3.92 47.1,5.11 13.92,14.02 13.7,15.33 15.49,15.06 14.58,15.07 16.34,15.49 17.28,15.47 28.14,5.7 16.76,0.67 22.85,2.12 26.09,0.62 32.61,11.65 28.82,0.67 30.28,0.67 13.61,0.62 12.59,0.62 11.65,0.62 10.76,0.64 8.88,0.66 4.83,3.87 4.03,3.86 3.31,3.45 2.39,3.44 1.42,3.37 5.28,0.61 4.42,0.6 18.59,24.09 2.83,6.38 3.07,4.43 32.4,3.34 29.3,4.86 5.56,8.14 40.2,19.33 40.21,18.47 14.31,5.56 14.47,3.75 46.41,12.85 48.72,10.13 48.7,11.23 46.11,11.11 33.26,9.99
  pour Top (isolate 0.254): 0,0 49.91,0 49.91,29.21 9.14,29.21 9.14,15.49 0,15.49
  pour Bottom (isolate 0.254): 0,0 49.91,0 49.91,29.21 9.17,29.21 9.17,16.28 0,16.26
GPIO0  (via drill 0.3 pad 0.3)
  Top 0.203: IC4.2 37.59,21.84 38.1,21.84 39.42,20.69 39.51,17.97 38.48,16.89 38.48,16.76 37.85,16.13 37.08,16.13 35.94,14.99 35.94,14.48 35.69,14.22 34.92,14.22 34.8,14.1 34.8,12.66 35.32,12.6 35.85,12.37 36.01,12.08 36.22,11.43 35.94,10.74 35.93,10.36 35.81,10.16 35.43,10.05 35.08,9.78 35.06,9.32 35.23,8.9 35.71,8.81 36.31,8.99 37.05,9.08 37.77,9.05 38.05,8.64 v37.94,8.32 | 19.57,4.62 20.12,4.08 20.46,4.08 v20.62,4.24
  Top 0.254: 19.57,4.62 IC3.9
  Bottom 0.203: v20.62,4.24 21.29,4.24 21.92,4.88 22.26,5.45 22.29,6.48 22.31,7 22.59,7.26 22.91,7.34 23.22,7.23 23.44,6.97 23.69,6.72 23.93,6.51 24.35,6.33 25.01,6.12 25.51,5.86 26.21,5.41 27.48,4.8 27.88,4.75 28.42,4.93 29.06,5.7 29.79,6.11 31.9,6.41 33.25,6.38 36.25,6.64 36.54,6.77 v37.94,8.32
GPSANT
  Top 0.203: 11.18,22.99 IC5.11_RF_IN | 9.14,22.99 L8.2
  Top 0.254: R4.2 7.24,22.57 U$3.FEED
  Top 0.406: U$3.FEED 9.14,22.99 11.18,22.99
MISO  (via drill 0.3)
  Top 0.203: v40.39,9.12 41.38,9.5 41.86,10.86 42.84,12.18 43.19,12.89 43.42,14.12 44.32,14.48 44.58,14.73 44.58,15.62 IC4.16 | v22.89,6.68 IC3.13
  Bottom 0.203: v40.39,9.12 40.26,9.14 37.77,6.17 38.01,5.31 37.59,4.61 37.59,3.68 36.83,2.92 35.69,2.92 34.16,1.65 J1.1 31.83,1.65 28.17,3.81 24.75,5.74 23.52,6.16 v22.89,6.68
MODULATION
  Top 0.203: R21.2 21.7,3.62 21.69,3.85 21.26,5.41 20.5,5.41 IC3.10
MOSI  (via drill 0.3)
  Top 0.203: v29.95,4 26.12,3.86 24.96,3.72 23.57,4.53 23.57,7.04 23.22,7.47 22.81,7.56 21.63,7.56 IC3.14 | v40.95,9.96 41.45,11.05 42.72,13.06 42.91,13.92 43.08,14.49 43.61,14.74 43.69,15.62 IC4.15
  Bottom 0.203: v29.95,4 32.44,2.43 33.01,2.93 34.42,2.92 36.2,4.19 J1.4 36.72,4.53 36.98,4.79 37.59,5.36 37.31,6.35 39.79,9.64 v40.95,9.96
N$1
  Bottom 0.203: R23.1 28.07,8.61 TCS3471.P$1
N$2
  Top 0.203: SDA.TP 11.23,17.44 IC5.16_SDA2
N$3
  Top 0.203: SCL.TP IC5.17_SCL2
N$4
  Top 0.203: L3.P$2 44.32,7.37
  Top 0.305: 44.32,7.37 IC2.3
N$5
  Top 0.203: R2.1 IC3.20
N$6  (via drill 0.3 pad 0.3)
  Top 0.203: 28.07,1.91 R7.1 | 29.59,1.91 C19.1 | 27.99,1.83 R7.1 | C19.1 29.52,1.91 28.17,1.91 R7.1 | R5.2 33.2,5.42 32.6,4.83 31.64,3.44 31.2,2.97 30.23,1.96 29.82,1.94 29.67,1.96 C19.1 | R21.1 v21.69,1.35 | v28.07,1.35 R7.1
  Top 0.406: C18.2 31.2,2.72 31.2,2.97
  Bottom 0.203: v21.69,1.35 v28.07,1.35
N$7
  Top 0.203: IC3.19 R1.1
N$8
  Bottom 0.203: U1.1 11.81,10.32 SJ1.2
N$9  (via drill 0.3)
  Top 0.203: 34.47,20.65 34.91,20.41 v34.11,19.65 | v36.16,17.22 36.68,17.93 37.47,18.03 IC4.7
  Top 0.406: 34.91,20.41 34.1,21.6 C3.1 | 34.47,20.65 34.61,20.65 U$1.P$2
  Bottom 0.203: v34.11,19.65 34.11,17.22 v36.16,17.22
N$10
  Top 0.203: 35.94,15.62 37.47,17.14 IC4.8 | 35.94,15.62 35.43,15.11 C4.1 | 35.94,15.62 34.8,16.76
  Top 0.406: U$1.P$1 34.8,16.87 34.8,16.76
N$11
  Top 0.203: LED4.A R2.2
N$12
  Top 0.203: R1.2 LED3.A
N$13
  Top 0.254: FVXO-HC53BR-27.4 26.39,11.18 25.88,10.67 25.91,10.77 C13.1 C14.1 | FVXO-HC53BR-27.4 26.64,11.18 26.63,11.16 | 26.59,11.14 26.61,11.14 26.63,11.16 | 26.63,11.16 26.63,11.19 27.69,10.13 FVXO-HC53BR-27.4INNER | FVXO-HC53BR-27.4INNER 27.69,9.89 26.6,10.98 FVXO-HC53BR-27.4 | FVXO-HC53BR-27.4 27.69,10.09 FVXO-HC53BR-27.4INNER
N$14
  Top 0.254: R4.1
  Top 0.406: R4.1 X1.1
N$15
  Bottom 0.203: U1.3 12.15,13.23 10.86,13.51 SJ3.2
N$16
  Bottom 0.203: SJ2.2 10.61,11.95 U1.2
N$17
  Bottom 0.203: R24.1 47.59,20.71 46.41,20.71 SPKR.P$1
N$19
  Top 0.203: 45.26,9.98 C22.1 | 45.47,8.38 IC2.1
  Top 0.406: 45.26,9.98 45.47,8.38
N$20
  Top 0.203: L6.P$2 26.81,17.41 26.82,19.13 28.19,19.16
  Top 0.254: 28.19,19.16 IC6.3
N$21  (via drill 0.3 pad 0.3)
  Top 0.203: 28.07,3.17 R7.2 | 29.59,3.17 C19.2 | FVXO-HC53BR-27.1INNER 29.72,7.11 30.73,6.1 FVXO-HC53BR-27.1 | 30.61,6.1 FVXO-HC53BR-27.1 | R7.2 28.14,3.2 29.52,3.2 C19.2 | C19.2 29.69,3.2 30.45,3.62 30.84,6.02 FVXO-HC53BR-27.1 | R7.2 26.71,3.19 26.02,3.19 v25.98,3.11 | 23.98,1.51 R22.2 24.14,1.52 24.42,1.52 24.82,1.8 v25.36,2.06
  Top 0.406: 26.71,3.19 R17.2
  Bottom 0.203: v25.98,3.11 25.43,2.15 v25.36,2.06
N$22
  Top 0.203: 27.18,20.95 IC6.1 | C24.1
  Top 0.254: C24.1 27.18,20.95
N$23
  Top 0.203: L7.2 15.81,6.58
  Top 0.305: 15.81,6.58 IC3.4
  Top 0.406: C5.2 15.81,6.58
N$24
  Top 0.813: C28.1 J$2.SIG
N$25
  Top 0.203: L10.1 16.33,7.07 IC3.3
  Top 0.254: L10.1 14.57,8.59 C26.2
N$26
  Top 0.203: IC3.2 16.5,7.59 16.4,8.5 L10.2
  Top 0.406: L10.2 L9.2 C27.2
N$27
  Top 0.406: L9.1 C26.1 L11.2
  Top 0.813: C5.1 L11.2
N$28
  Top 0.406: C33.1 7.77,6.18 | 8.98,9.54 C35.2
  Top 0.813: 7.77,6.18 L12.1 L13.2 8.98,9.54 | C30.2 C33.1
N$29
  Top 0.61: ENABLE.3 ENABLE.2
N$30
  Top 0.203: R12.2 11.05,19.81 11.18,19.68 IC5.14_VCC_RF
N$31
  Top 0.203: 7.99,19.44 R12.1 7.87,19.81 | 7.99,19.44 C34.1 | 7.99,19.44 8.51,20.08 L8.1
N$32
  Top 0.203: R14.1 22.61,18.92 21.46,18.8 IC5.4_TIMEPULSE
N$33
  Top 0.203: R14.2 LED1.C
N$34
  Top 0.813: L11.1 L12.2 C33.2 C29.2
N$35
  Top 0.813: C35.1 9.31,11.23 L13.1 7.75,12.5 C31.2 C28.2
N$36
  Top 0.203: LED2.A 48.9,15.62 48.9,16.54 R16.1
N$41
  Top 0.203: R9.1 19.07,4.36
  Top 0.254: 19.07,4.36 IC3.8
  Top 0.406: C36.2 19.82,3.43 R9.1
RADIO_IRQ  (via drill 0.3)
  Top 0.203: IC4.32 39.37,22.66 40.55,21.67 40.93,19.37 40.93,16.92 v42.42,16.89 | v34.44,7.51 33.86,6.66 33.35,6.17 32.69,5.55 32.08,4.94 30.71,3.3 30.23,2.54 27.38,2.55 25.67,2.55 24.61,3.44 23.99,3.82 23.99,3.8 22.14,3.8 21.51,6.06 21.09,6.08 21.09,6.07 | 21.09,6.07 | IC3.11 21.09,6.07
  Bottom 0.203: v42.42,16.89 41.99,15.37 41.4,14.12 39.42,12 35.92,7.48 34.51,7.48 v34.44,7.51
RADIO_SDN  (via drill 0.3)
  Top 0.203: IC4.11 v40.89,14.48 | R10.2 16.71,9.5 v17.42,8.85 17.07,8.1 17.07,8.07 IC3.1
  Bottom 0.203: v40.89,14.48 40.5,13.73 39.62,12.87 38.47,11.47 35.98,8.22 34.39,8.13 34.11,8.05 33.93,7.86 33.72,7.63 33.27,7.35 31.83,7.24 30.92,7.19 28.97,6.84 26.59,6.84 26.14,7.12 24.73,8.45 23.36,9.91 17.49,9.91 17.49,9.92 v17.42,8.85
RESET  (via drill 0.3)
  Top 0.203: R3.2 36.78,24 37.46,23.99 | 37.46,23.99 37.59,23.99 38.14,24.05 v38.14,24.07 | 41.33,24.28 41.27,24.26 IC4.29 | v45.06,4.57 45.06,3.34 44.45,2.79 42.8,2.79 41.83,1.64 41.24,1.04 40.45,1.12 J1.5 | RST.TP 37.46,23.99 | v41.41,23.1 41.77,19.49 v42.24,18.03 | v39.83,13.92 R15.1
  Top 0.254: 41.33,24.28 v41.41,23.1
  Bottom 0.203: v38.14,24.07 41.38,24.07 45.59,24.07 47.5,24.09 47.5,23.05 48.54,22.33 48.54,20.32 48.25,19.51 47.47,17.29 47.5,8.13 v45.06,4.57 | v42.24,18.03 42.13,17.45 41.78,16.98 41.77,16.93 41.58,16.57 40.53,15.24 40.41,14.82 40.27,14.45 v39.83,13.92
  Bottom 0.254: v41.41,23.1 41.38,24.07
RTC  (via drill 0.3)
  Top 0.254: RTC.6 v21.87,13.66 TP1.TP | v37.87,13.27 37.91,13.98 R15.2
  Bottom 0.254: v37.87,13.27 37.26,12.95 37.27,12.98 36.47,12.7 31.69,12.7 23.79,12.71 v21.87,13.66
SCK  (via drill 0.3)
  Top 0.203: R16.2 46.1,17.14 IC4.17 45.97,17.02 45.85,17.02 45.85,12.19 v45.97,12.06 | v22.87,5.84 21.93,6.44 IC3.12
  Bottom 0.203: v45.97,12.06 42.76,8.47 40.64,7.05 40.64,4.06 39.5,2.92 37.59,2.92 J1.3 35.05,0.39 32.87,0.39 31.43,1.38 25.48,4.88 24.42,5.44 v22.87,5.84
SCL  (via drill 0.3)
  Top 0.203: 39.69,9.26 40.72,10.6 | 40.72,10.6 41.19,11.48 41.26,12.61 v41.27,12.65 | 39.37,8.42 R19.2 | v42.89,17.58 42.88,18.25 42.49,18.94 42.19,19.6 42.09,20.31 41.96,22.3 42.05,22.76 42.14,23.13 IC4.28 42.16,24.13 | R19.2 39.37,8.41 39.73,9.3 40.72,10.6 | v20.55,13.69 RTC.8 | v35.75,9.5 36.5,9.77 U$2.P$5 37.39,9.88 R19.2
  Top 0.305: IC4.28 42.18,25.08 40.64,26.62
  Bottom 0.152: 30.3,10.43 30.01,10.17 30.01,9.54 29.81,9.26
  Bottom 0.203: v41.27,12.65 41.87,14.11 43.03,16.64 43.03,17.09 v42.89,17.58 | v35.75,9.5 31.95,9.16 31.6,9.86 31.52,10.2 31.36,10.41 30.3,10.43 | 29.81,9.26 29.29,9.26 | 29.29,9.26 28.79,9.26 28.4,9.5 27.16,9.5 26.16,9.04 25.59,9.07 22.72,12.17 v20.55,13.69 20.46,13.2 20.43,13.22 20.41,13.2 20.41,13.18 20.34,13.21 19.36,13.18 18.22,13.18 U1.6 | TCS3471.P$2 29.29,9.26
SDA  (via drill 0.3)
  Top 0.203: 37.02,11.39 37.35,10.73 37.66,10.54 38.2,10.07 v39.26,10.07 | 37.02,11.39 37.02,11.75 36.01,13.21 35.56,13.21 35.56,13.46 R18.2 | v44.21,17.93 43.17,20.65 42.47,20.98 42.37,22.17 42.85,23.32 43.05,24.26 IC4.27 | RTC.1 v19.67,11.61 | v36.5,10.59 36.6,10.96 36.65,11.06 U$2.P$6 36.98,11.38 37.02,11.39
  Top 0.305: IC4.27 42.98,26.85
  Bottom 0.203: v44.21,17.93 44.32,17.69 44.69,17.3 45.2,15.95 45.77,14.03 45.85,13.21 45.21,11.94 42.95,9.64 42.42,9.74 40.93,10.64 40.22,10.21 v39.26,10.07 | 30.77,8.59 30.21,8.17 29.7,8.09 28.66,8.09 28.41,8.18 27.04,8.18 25.34,8.64 22.62,11.58 v19.67,11.61 19.2,12.08 19.2,12.39 19,12.6 15.98,12.6 15.91,12.62 15.91,13.89 16.51,14.49 U1.5 | 30.77,8.59 31.8,8.6 32.36,8.62 35.04,8.88 35.93,8.87 36.23,9.17 36.46,9.53 v36.5,10.59 | TCS3471.P$6 30.77,8.59
SS  (via drill 0.3)
  Top 0.203: v42.2,13.39 42.71,14.87 43.05,15.75 IC4.14 | IC3.15 21.45,8.07 arc-90 21.59,7.94 v24.02,7.98
  Bottom 0.203: v24.02,7.98 24.05,7.92 26.57,6.35 29.16,6.41 32,6.84 33.24,6.82 36.11,7.04 38.84,10.45 39.87,11.7 41.49,12.08 41.82,12.38 42.08,12.83 v42.2,13.39
TX_ENABLE  (via drill 0.3)
  Top 0.203: FVXO-HC53BR-27.2INNER 30.86,8.64 | 30.86,8.64 FVXO-HC53BR-27.2 31.11,8.64 | v39.08,13.13 39.99,13.31 41.43,14.05 41.57,14.95 IC4.12 | 30.86,8.64 v32.19,10.22
  Bottom 0.203: v39.08,13.13 38.49,12.29 37.87,12.24 37.49,12.08 36.98,11.76 36.73,11.6 35.97,11.49 35.2,11.33 v32.19,10.22
UBLOX_ENABLE  (via drill 0.3)
  Top 0.203: v29.87,23.89 29.21,23.88 IC6.6 | v39.24,16.76 39.24,16 38.99,15.75 IC4.9
  Bottom 0.203: v29.87,23.89 31.88,23.88 32.4,21.4 32.69,19.96 32.51,19.11 31.88,16.28 37.4,16.08 38.61,16.76 v39.24,16.76
UBLOX_RESET  (via drill 0.3)
  Top 0.203: IC5.9_V_RESET 20.7,24 22.35,24 R13.1 22.35,24.13 23.11,24.89 26.16,24.89 v26.54,24.51 | v37.35,15.48 37.72,15.37 38.44,14.69 38.44,12.72 39.03,12.39 39.87,12.71 41.69,13.68 41.83,13.89 41.97,14.48 42.16,15.62 IC4.13
  Bottom 0.203: v37.35,15.48 36.96,15.62 31.42,15.85 31.04,19.98 v26.54,24.51
UBLOX_RXD  (via drill 0.3, 0.3 pad 0.3)
  Top 0.203: v39.93,23.1 39.75,23.62 39.75,24.13 IC4.31 | v33.29,22.26 32.49,21.69 32.46,21.55 32.46,19.88 30.07,19.88 v29.84,20.32 | v19.18,18.54 19.68,17.65 20.57,17.4 IC5.3_RXD1 | RXD.TP v22.84,20.47
  Bottom 0.203: v33.29,22.26 v39.93,23.1 | 22.8,20.52 21.95,20.38 v19.18,18.54 18.06,18.54 SERIAL.2 | 22.8,20.52 22.84,20.41 23.2,17.95 25.32,14.81 28.59,14.97 30.59,15.05 30.61,19.25 v29.84,20.32 | v22.84,20.47 22.87,20.47 22.78,20.46 22.8,20.52
UBLOX_TXD  (via drill 0.3)
  Top 0.203: 19.94,16.26 20.57,16.26 IC5.2_TXD1 | IC4.30 40.64,22.68 40.97,22.07 41.35,19.48 v41.53,17.64 | 20.68,16.29 20.66,16.33 IC5.2_TXD1 21.68,16.07 21.93,15.66 21.93,14.74 22.26,14.07 23.46,14.07 24.03,14.35 v25.73,14.11 TXD.TP
  Top 0.254: IC4.30 | v25.73,14.11 25.69,13.99 | v19.19,16.32 19.94,16.26
  Top 0.406: IC5.2_TXD1
  Bottom 0.203: v41.53,17.64 40.95,17.06 39.09,15.15 37.2,14.24 33.82,14.61 31.01,14.61 30.72,14.53 30.11,14.46 28.98,14.08 v25.73,14.11 | SERIAL.1 17.74,16.32 v19.19,16.32
UBLOX_VCC
  Top 0.203: 20.07,22.35 20.57,21.84 IC5.7_VCC_IO 20.7,21.84 23.48,21.84 C2.1 23.5,22.73 22.35,22.73 R13.2 | 20.07,22.35 19.43,22.99 19.43,24.38 20.32,25.27 26.67,25.27 27.18,24.77 27.18,23.88 IC6.10 | 20.07,22.35 20.57,22.86 IC5.8_VCC | 22.61,14.86 LED1.A 22.94,14.72 23.65,14.73 | 23.65,14.73 R11.2 | 23.65,14.73 23.29,14.8 | 27.69,20.45 27.69,20.83 IC6.2 | 24.36,19.61 26.24,19.61 23.84,17.58 | 23.84,17.58 23.65,14.73 | C25.1 23.84,17.58 | 3.3VGPS.TP 23.86,19.97
  Top 0.254: 27.69,20.45 27.3,20.04 26.24,19.61 | 24.36,19.61 23.85,19.95 23.86,19.97 23.48,21.84
VBAT  (via drill 0.3)
  Top 0.203: L6.P$1 30.7,17.4 30.7,19.18 29.21,19.18
  Top 0.254: 45.59,6.35 IC2.5 | C21.1 | IC6.8 28.19,23.88 28.57,23.88 IC6.7 28.57,24 | 30.61,20.95 C20.1 30.61,20.95 | 30.61,20.95 29.21,20.95 IC6.5 29.21,19.18 | IC2.6 48.51,6.48 48.51,6.86 IC2.7 48.51,6.99 48.51,7.37 IC2.8 | 48.9,21.97 R6.1 48.67,22.62 v48.49,23.1
  Top 0.406: 45.74,5.33 45.73,2.02 JP3.1 C21.1 | 45.74,5.33 45.59,6.35 | v28.57,24.59 28.57,24 | 30.61,20.95 v30.61,22.35 | v48.77,14.01 49.52,12.84 49.52,7.67 49.51,6.88 IC2.7 48.49,6.26 v48.77,5.59 | L3.P$1 44.96,5.33 45.74,5.33 | +BAT.TP v48.08,24.77
  Bottom 0.254: 48.44,23.05 v48.49,23.1 | v48.08,24.77
  Bottom 0.406: v28.57,24.59 28.57,24.26 28.55,24.24 | 28.55,24.24 30.35,22.48 v30.61,22.35 | v48.49,23.1 49.34,22.16 49.34,20.87 48.78,19.36 48.78,14.82 v48.77,14.01 | 28.55,24.24 29.81,24.57 37.03,24.51 37.82,24.8 48.08,24.8 v48.08,24.77 48.09,23.37 48.44,23.05 | JP3.1 45.97,2.79 v48.77,5.59
VCC  (via drill 0.3, 0.3 pad 0.3)
  Top 0.203: R20.2 47.56,17.97 46.63,17.97 46.1,18.03 IC4.18 45.97,17.91 45.47,17.91 45.09,17.53 45.09,16.51 45.21,16.38 45.21,13.59 44.7,13.08 C23.1 44.58,13.08 44.58,12.7 43.56,11.68 43.56,9.46 44.67,9.46 44.67,8.13 44.7,8.13 | 45.05,7.86 45.55,7.86 IC2.2 | v48.06,9.17 48.13,8.89 48.39,8.64 48.39,8.38 IC2.10 | v41.86,2.67 40.89,2.79 40.51,3.17 40.44,8.09 | 36.65,20.43 35.75,21.63 34.66,22.34 34.66,24.05 R3.1 3.3V.TP | 36.65,20.43 37.47,20.45 IC4.4 37.59,20.32 36.59,20.36 | 36.59,20.36 36.65,20.43 | 33.33,17.86 32.14,18.19 C10.1 | 33.33,17.86 36.03,18.54 37.47,18.67 IC4.6 37.59,18.8 36.88,18.87 36.6,19.05 36.59,20.36 | FVXO-HC53BR-27.6INNER 27.69,7.11 26.67,6.1 FVXO-HC53BR-27.6 27.18,6.73 | 34.16,13.46 33.96,13.3 34.67,11.68 34.67,9.89 | 34.67,8.59 34.67,8.51 34.52,8.47 | 34.67,8.59 34.67,9.89 | 35.27,8.26 34.67,8.59 | 34.16,13.46 R18.1 | C32.1 32.46,14.19 32.24,14.07 v32.24,13.34 | 21.34,20.74 21.04,20.74 20.7,20.7 IC5.6_V_BCKP | 21.34,20.74 21.32,20.77 | v22.29,19.76 21.34,20.74 | J1.2 35.29,5.4 35.29,7.56 | 33.33,17.86 33.33,16.2 33.53,15.88 34.54,15.88 34.67,15.75 34.67,14.48 34.16,13.97 34.16,13.46 | 39.38,7.12 R19.1 | C7.1 C9.2 | 15.74,3.99 L7.1 | R9.2 18.07,4.27 | C38.2 v22.86,4.97 | C6.2 C8.1 | C12.1 24.09,12.93 | R22.1 23.91,3.11 v23.88,3.21 | 33.87,8.38 U$2.P$3 | U$2.P$2 34.66,9.88 34.67,9.89 | C11.1 11.79,5.2 | 11.79,5.2 11.65,5.35 | v11.68,5.94 11.72,5.83 11.79,5.2
  Top 0.254: 18.07,4.27 IC3.6
  Top 0.305: 44.7,8.13 45.05,7.86 | 44.67,8.13 40.51,8.13 40.44,8.09
  Top 0.406: 40.44,8.09 39.38,7.12 35.29,7.56 35.27,8.26 34.67,8.51 | 33.96,13.3 v32.24,13.34 | v26.59,7.57 27.18,6.73 | R9.2 C8.1 C7.1 15.74,3.99 v16.78,3.87 | L7.1 C11.1 | FVXO-HC53BR-27.6 v24.22,4.88 | v33.06,7.92 33.87,8.38 | RTC.5 24.04,12.8 C12.1 | 24.09,12.93 v24.09,13.69 | U$2.P$3 34.52,8.47
  Bottom 0.203: v48.06,9.17 48.49,8.76 48.08,8.06 47.83,7.51 45.5,4.09 43.97,2.82 42.44,2.83 v41.86,2.67 | 24.92,14 22.29,17.84 v22.29,19.76 | v22.86,4.97 24.19,4.86 24.18,4.88 | v23.88,3.21 23.88,4.53 v24.22,4.88 | R23.2 27.79,7.37 FVXO-HC53BR-27.6INNER 27.48,7.57 v26.59,7.57 | U1.8 17.37,10.71 16.13,10.71 14.36,8.97 | 14.36,8.97 11.87,6.45 v11.68,5.94 | 14.36,8.97 C17.2 14.35,8.86 C37.1
  Bottom 0.406: v16.78,3.87 19.52,3.96 20.13,3.26 21.37,3.17 22.82,5 v24.22,4.88 24.21,4.86 24.19,4.86 | v26.59,7.57 29.13,7.56 31.17,7.72 31.81,7.73 v33.06,7.92 | v32.24,13.34 25.76,13.34 25.31,13.42 24.92,14 v24.09,13.69
  pour Top (no thermals): 15.93,3.86 15.93,2.73 17.68,2.76 17.68,3.86
XIN
  Top 0.254: IC3.17 19.56,9.09 19.56,9.93 22.23,9.93 | 22.23,9.93 22.45,9.93 C13.2 | C15.2 22.23,9.93
XOUT
  Top 0.254: IC3.16 20.08,9.42 20.98,9.42 21.12,9.38 | 21.12,9.38 21.57,9.25 22.81,9.25 C14.2 | 21.08,9.35 21.12,9.38

### Text on the board
tTest: W2CXM | Ursus Minimus 1 | W2CXM | 1 | UM1 | 1 | 1 | 1 | 1 | 1 | UM1 | 1 | + | 1 | GND
bTest: 1 | Ursus / Minimus | If found, please contact / balloon@w2cxm.org. | W2CXM | W2CXM | GND | RX | 2013-11-11 | TX | http://w2cxm.org | 1 | 1 | GND | +